# EAGLE design Nathan_Project-Speaker (EAGLE 8.3.2)
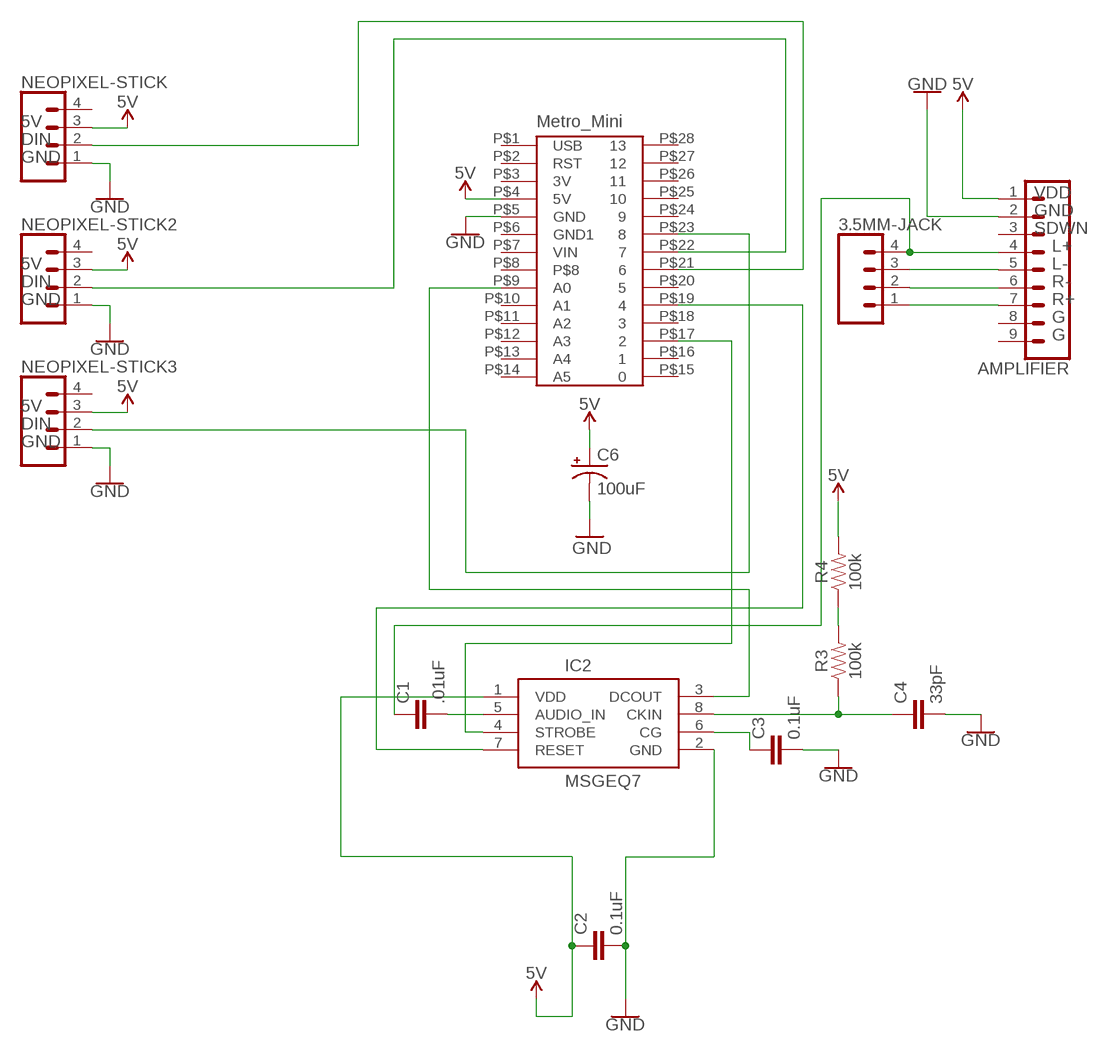
[diagram p0: schematic, sheet 1]

## Parts
3.5MM-JACK  CONN_04LOCK_LONGPADS  [1X04_LOCK_LONGPADS]
AMPLIFIER  CONN_09LOCK-LONGPADS  [1X09_LOCK_LONGPADS]
C1  .01uF  C5/2.5  [C5B2.5]
C2  0.1uF  C5/2.5  [C5B2.5]
C3  0.1uF  C5/2.5  [C5B2.5]
C4  33pF  C5/2.5  [C5B2.5]
C6  100uF  100UF-POLAR-RADIAL-2.5MM-25V-20%  [CPOL-RADIAL-2.5MM-6.5MM]
IC2  MSGEQ7P  MSGEQ7DIL  [DIP08]
NEOPIXEL-STICK  CONN_04LOCK_LONGPADS  [1X04_LOCK_LONGPADS]
NEOPIXEL-STICK2  CONN_04LOCK_LONGPADS  [1X04_LOCK_LONGPADS]
NEOPIXEL-STICK3  CONN_04LOCK_LONGPADS  [1X04_LOCK_LONGPADS]
R3  100k  100KOHM-HORIZ-1/4W-1%  [AXIAL-0.3]
R4  100k  100KOHM-HORIZ-1/4W-1%  [AXIAL-0.3]
U$2  METRO-MINI  [METRO-MINI]

## Nets
5V: AMPLIFIER.1 C2.1 C6.1(+) IC2.1(VDD) NEOPIXEL-STICK2.3 NEOPIXEL-STICK3.3 NEOPIXEL-STICK.3 R4.P$2 U$2.P$4(5V)
DIN: NEOPIXEL-STICK.2 U$2.P$21
GND: AMPLIFIER.2 C2.2 C3.2 C4.2 C6.2(-) IC2.2(GND) NEOPIXEL-STICK2.1 NEOPIXEL-STICK3.1 NEOPIXEL-STICK.1 U$2.P$5(GND)
N$1: C4.1 IC2.8(CKIN) R3.P$1
N$2: IC2.4(STROBE) U$2.P$17
N$3: NEOPIXEL-STICK3.2 U$2.P$23
N$4: 3.5MM-JACK.4 AMPLIFIER.4 C1.1
N$5: 3.5MM-JACK.3 AMPLIFIER.5
N$6: 3.5MM-JACK.2 AMPLIFIER.6
N$7: 3.5MM-JACK.1 AMPLIFIER.7
N$8: C3.1 IC2.6(CG)
N$9: R3.P$2 R4.P$1
N$10: C1.2 IC2.5(AUDIO_IN)
N$11: IC2.7(RESET) U$2.P$19
N$12: IC2.3(DCOUT) U$2.P$9(A0)
N$14: NEOPIXEL-STICK2.2 U$2.P$22
Unconnected: AMPLIFIER.3 AMPLIFIER.8 AMPLIFIER.9 NEOPIXEL-STICK2.4 NEOPIXEL-STICK3.4 NEOPIXEL-STICK.4 U$2.P$1(USB) U$2.P$2(RST) U$2.P$3(3V) U$2.P$6(GND1) U$2.P$7(VIN) U$2.P$8 U$2.P$10(A1) U$2.P$11(A2) U$2.P$12(A3) U$2.P$13(A4) U$2.P$14(A5) U$2.P$15 U$2.P$16 U$2.P$18 U$2.P$20 U$2.P$24 U$2.P$25 U$2.P$26 U$2.P$27 U$2.P$28

## Notes on the sheet
- 5V
- DIN
- GND
- VDD
- GND
- SDWN
- L+
- 5V | L-
- DIN | R-
- GND | R+
- G
- G
- 5V
- DIN
- GND

## Library data of the parts
3.5MM-JACK NEOPIXEL-STICK NEOPIXEL-STICK2 NEOPIXEL-STICK3 = SparkFun-Connectors:CONN_04: Multi connection point. Often used as Generic Header-pin footprint for 0.1 inch spaced/style header connections On any of the 0.1 inch spaced packages, you can populate with these: Break Away Headers - Straight <https://www.sparkfun.com/products/116> (PRT-00116) Break Away Male Headers - Right Angle <https://www.sparkfun.com/products/553> (PRT-00553) Female Headers <https://www.sparkfun.com/products/115> (PRT-00115) Break Away Headers - Machine Pin <https://www.sparkfun.com/products/117> (PRT-00117) Break Away Female Headers - Swiss Machine Pin <https://www.sparkfun.com/products/743> (PRT-00743) For SCREWTERMINALS and SPRING TERMINALS visit here: Screw Terimnals on SparkFun.com <https://www.sparkfun.com/search/results?term=Screw+Terminals> (5mm/3.5mm/2.54mm spacing) This device is also useful as a general connection point to wire up your design to another part of your project. Our various solder wires solder well into these plated through hole pads. Hook-Up Wire - Assortment (Stranded, 22 AWG) <https://www.sparkfun.com/products/11375> (PRT-11375) Hook-Up Wire - Assortment (Solid Core, 22 AWG) <https://www.sparkfun.com/products/11367> (PRT-11367) View the entire wire category on our website here <https://www.sparkfun.com/categories/141> Special notes: Molex polarized connector foot print use with SKU : PRT-08231 with associated crimp pins and housings. 1MM SMD Version SKU: PRT-10208; PROD_ID: CONN-09696
AMPLIFIER = SparkFun-Connectors:CONN_09: Multi connection point. Often used as Generic Header-pin footprint for 0.1 inch spaced/style header connections On any of the 0.1 inch spaced packages, you can populate with these: Break Away Headers - Straight <https://www.sparkfun.com/products/116> (PRT-00116) Break Away Male Headers - Right Angle <https://www.sparkfun.com/products/553> (PRT-00553) Female Headers <https://www.sparkfun.com/products/115> (PRT-00115) Break Away Headers - Machine Pin <https://www.sparkfun.com/products/117> (PRT-00117) Break Away Female Headers - Swiss Machine Pin <https://www.sparkfun.com/products/743> (PRT-00743) For SCREWTERMINALS and SPRING TERMINALS visit here: Screw Terimnals on SparkFun.com <https://www.sparkfun.com/search/results?term=Screw+Terminals> (5mm/3.5mm/2.54mm spacing) This device is also useful as a general connection point to wire up your design to another part of your project. Our various solder wires solder well into these plated through hole pads. Hook-Up Wire - Assortment (Stranded, 22 AWG) <https://www.sparkfun.com/products/11375> (PRT-11375) Hook-Up Wire - Assortment (Solid Core, 22 AWG) <https://www.sparkfun.com/products/11367> (PRT-11367) View the entire wire category on our website here <https://www.sparkfun.com/categories/141> Special notes: Molex polarized connector foot print use with SKU : PRT-08231 with associated crimp pins and housings. 1MM SMD Version SKU: PRT-10208 NOTES ON THE VARIANTS LOCK and LOCK_LONGPADS... This footprint was designed to help hold the alignment of a through-hole component (i.e. 6-pin header) while soldering it into place. You may notice that each hole has been shifted either up or down by 0.005 of an inch from it's more standard position (which is a perfectly straight line). This slight alteration caused the pins (the squares in the middle) to touch the edges of the holes. Because they are alternating, it causes a "brace" to hold the component in place. 0.005 has proven to be the perfect amount of "off-center" position when using our standard breakaway headers. Although looks a little odd when you look at the bare footprint, once you have a header in there, the alteration is very hard to notice. Also,if you push a header all the way into place, it is covered up entirely on the bottom side.
C1-C4 = NathanLibrary:C: CAPACITOR naming: grid - package width
C6 = NathanLibrary:100UF-POLAR: 100µF polarized capacitors A capacitor is a passive two-terminal electrical component used to store electrical energy temporarily in an electric field.; PROD_ID: CAP-08439
IC2 = SparkFun-IC-Special-Function:MSGEQ7: 7-band graphic equalizer This IC is for making a 7 band/channel audio spectrometer. There are two versions of this part. The DIP available on the storefront, and the SO used in product. Datasheet <https://www.sparkfun.com/datasheets/Components/General/MSGEQ7.pdf> SparkFun Products Storefront component: Graphic Equalizer Display Filter - MSGEQ7 <https://www.sparkfun.com/products/10468> (COM-10468) SparkFun Spectrum Shield <https://www.sparkfun.com/products/13116> (DEV-13116); PROD_ID: IC-12196
R3 R4 = NathanLibrary:100KOHM: 100kΩ resistor A resistor is a passive two-terminal electrical component that implements electrical resistance as a circuit element. Resistors act to reduce current flow, and, at the same time, act to lower voltage levels within circuits. - Wikipedia; PROD_ID: RES-12184
U$2 = Metro-Nate:METRO-MINI

## Net classes
0 default: width 0.457 mm, drill 0.457 mm, clearance 0.457 mm

## Board
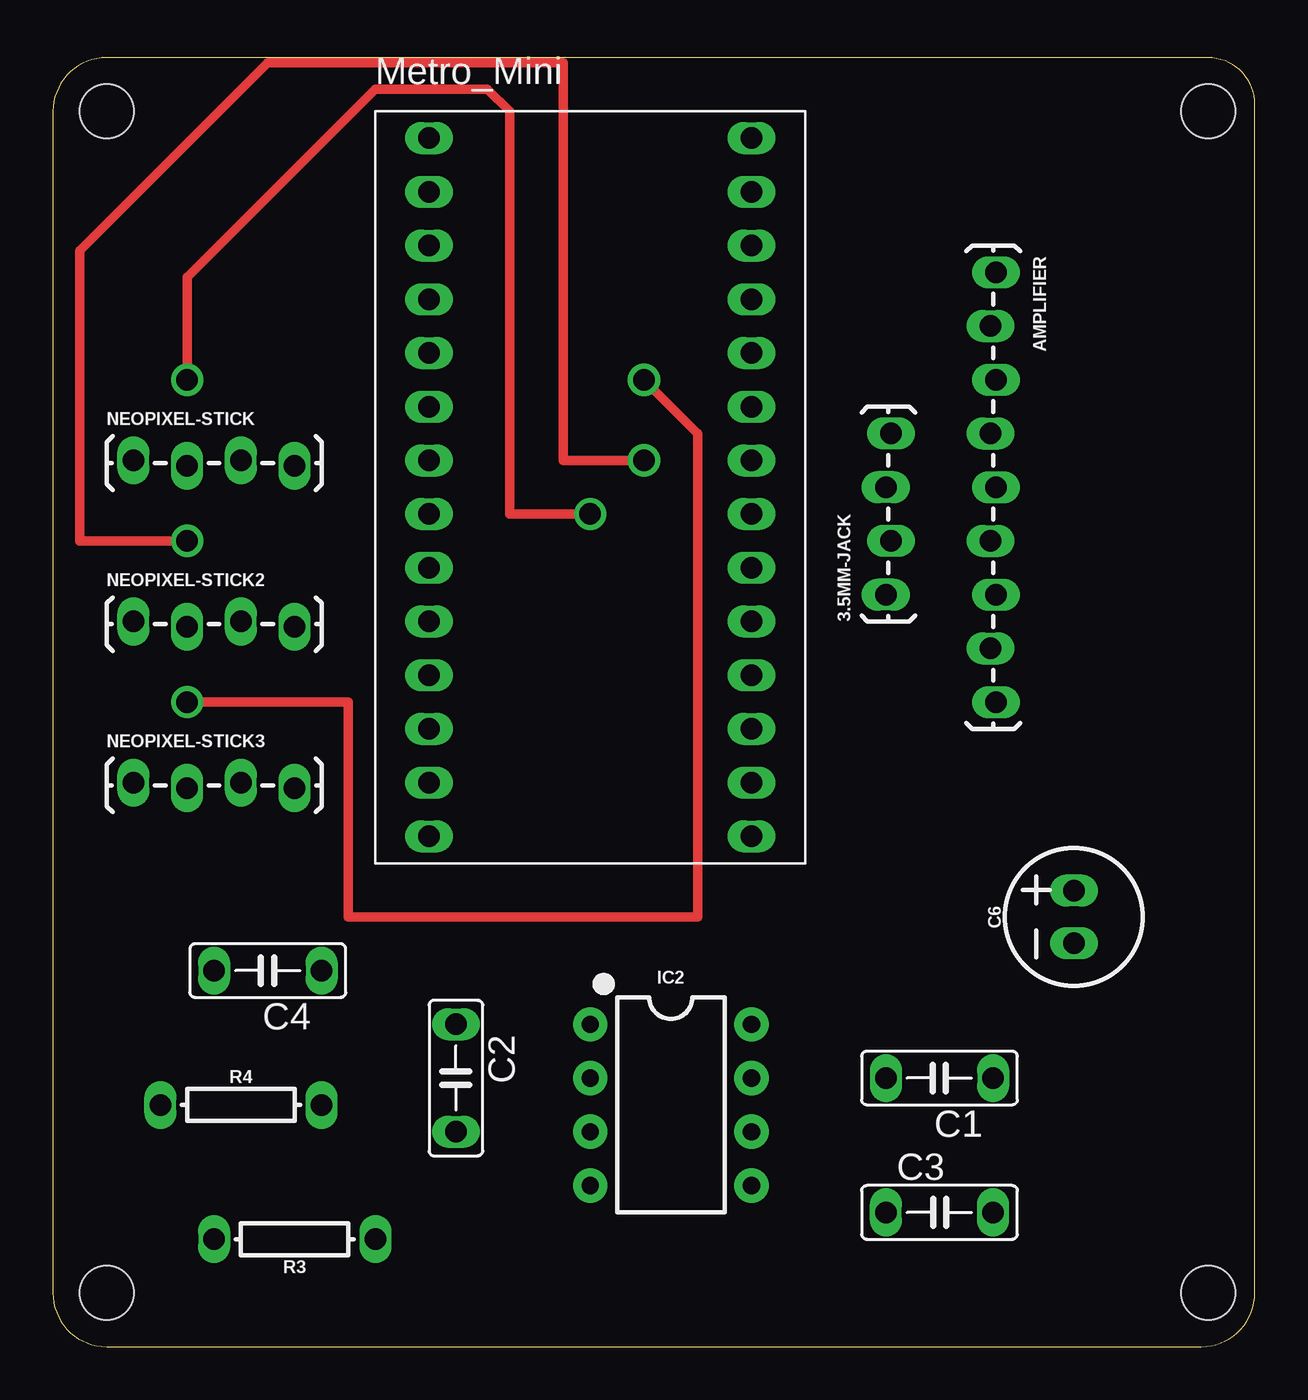
[diagram p1: board, top side]
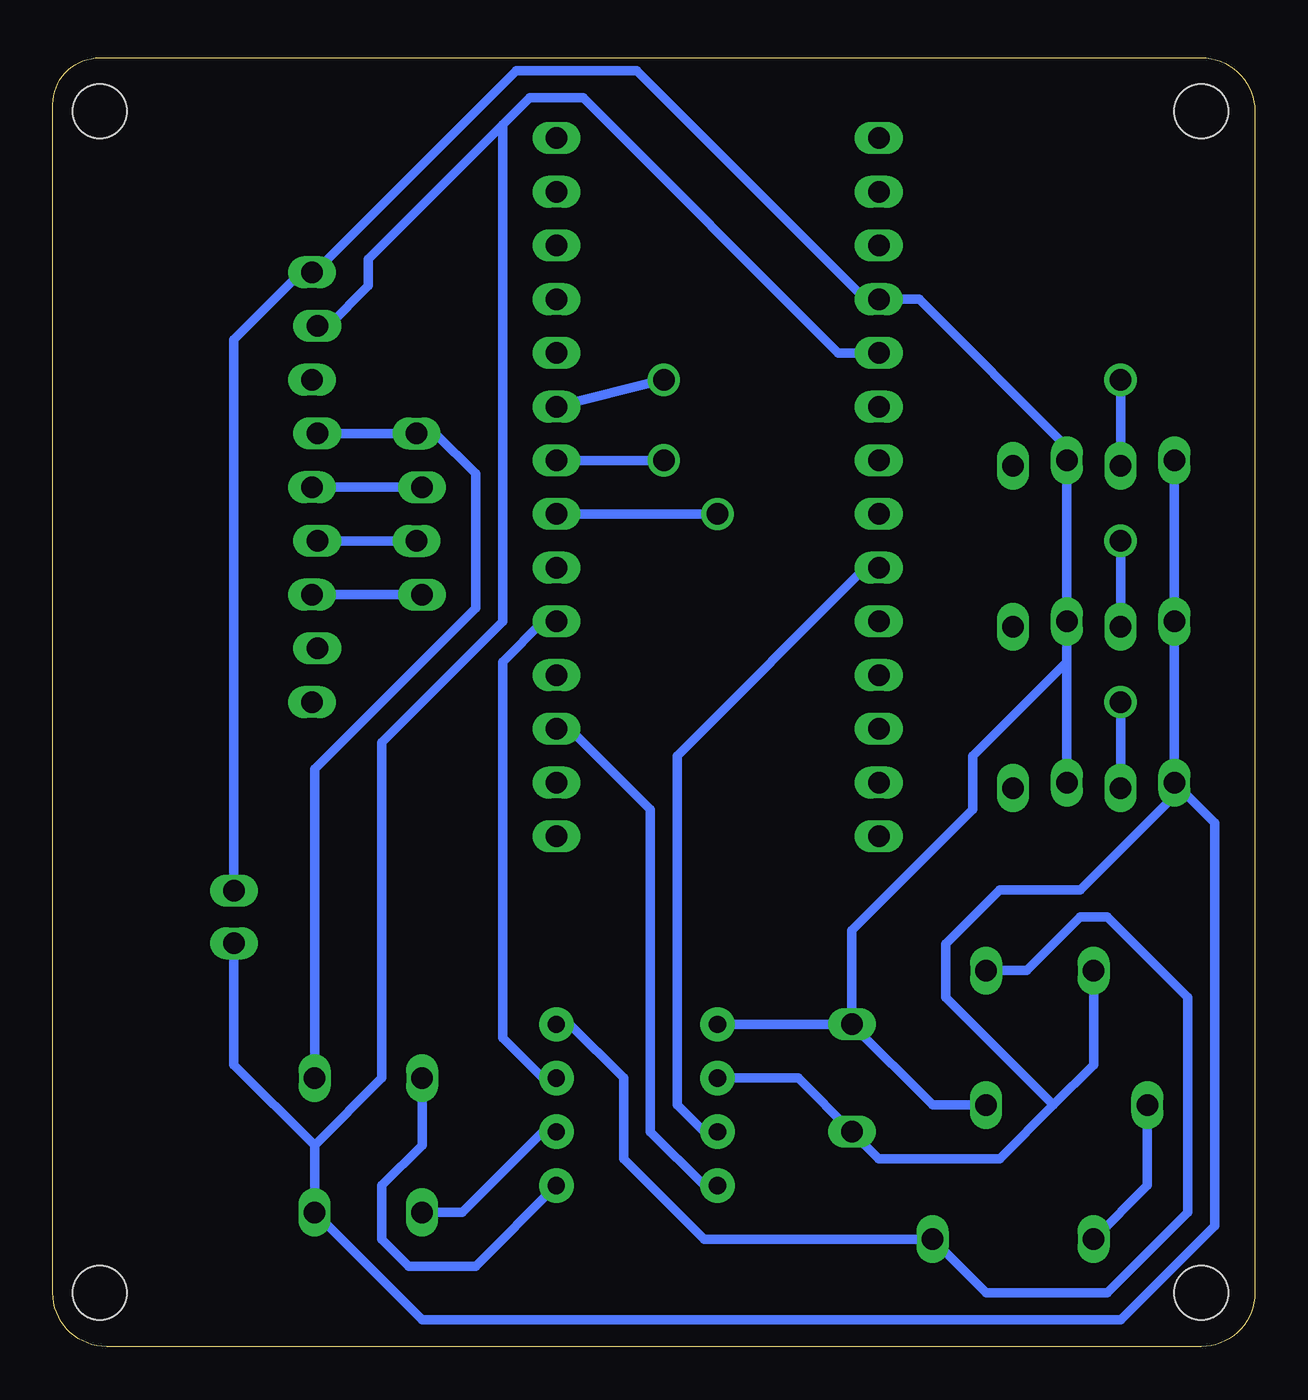
[diagram p2: board, bottom side, seen from below]

Size 56.82 x 60.95 mm. Coordinates in mm from the lower left corner, seen from the top.
Outline: 0,58.41 0,2.54 arc90 2.54,0 54.28,0 arc90 56.82,2.54 56.82,58.74 arc90 54.61,60.95 2.54,60.95 arc90 0,58.41
Copper layers (1*16): Top 0.035mm / dielectric 1.5mm / Bottom 0.035mm
Design rules "Othermill-DRC-1-32": minimum track width 8mil, minimum drill 0.8mm, track to track 0.794003125mm, track to pad 0.794003125mm, pad to pad 0.794003125mm, via to via 0.794003125mm, smd to smd 0mil, copper to edge 0mil, drill to drill 1mil, minimum pad ring 10mil, minimum via ring 10mil, stop-mask expansion 1mil, vias tented up to drill 30mil, thermal gap 10mil
Holes 2.54 mm at 2.54,2.54 54.61,2.54 54.61,58.42 2.54,58.42

### Footprints (pad centres in the part's own frame; a part is rotated, then mirrored left to right if it is on the bottom)
1X04_LOCK_LONGPADS = drill 1.016 long: 1 0,0; 2 2.54,-0.254; 3 5.08,0; 4 7.62,-0.254
1X09_LOCK_LONGPADS = drill 1.016 long: 1 0,0.127; 2 2.54,-0.127; 3 5.08,0.127; 4 7.62,-0.127; 5 10.16,0.127; 6 12.7,-0.127; 7 15.24,0.127; 8 17.78,-0.127; 9 20.32,0.127
C5B2.5 = drill 1.016 long: 1 -2.54,0; 2 2.54,0
CPOL-RADIAL-2.5MM-6.5MM = drill 1.016 long: 1 1.25,0; 2 -1.25,0
DIP08 = drill 0.813 pad 1.626: 1 -3.81,-3.81; 2 -1.27,-3.81; 3 1.27,-3.81; 4 3.81,-3.81; 5 3.81,3.81; 6 1.27,3.81; 7 -1.27,3.81; 8 -3.81,3.81
AXIAL-0.3 = drill 1.016 long: P$1 -3.81,0; P$2 3.81,0
METRO-MINI = drill 1.016 long: P$1 -7.62,16.51; P$2 -7.62,13.97; P$3 -7.62,11.43; P$4 -7.62,8.89; P$5 -7.62,6.35; P$6 -7.62,3.81; P$7 -7.62,1.27; P$8 -7.62,-1.27; P$9 -7.62,-3.81; P$10 -7.62,-6.35; P$11 -7.62,-8.89; P$12 -7.62,-11.43; P$13 -7.62,-13.97; P$14 -7.62,-16.51; P$15 7.62,-16.51; P$16 7.62,-13.97; P$17 7.62,-11.43; P$18 7.62,-8.89; P$19 7.62,-6.35; P$20 7.62,-3.81; P$21 7.62,-1.27; P$22 7.62,1.27; P$23 7.62,3.81; P$24 7.62,6.35; P$25 7.62,8.89; P$26 7.62,11.43; P$27 7.62,13.97; P$28 7.62,16.51

### Placement (x,y rotation side)
3.5MM-JACK  39.37,35.56 90 top
AMPLIFIER  44.45,50.8 270 top
C1  41.91,12.7 180 top
C2  19.05,12.7 270 top
C3  41.91,6.35 0 top
C4  10.16,17.78 180 top
C6  48.26,20.32 90 top
IC2  29.21,11.43 270 top
NEOPIXEL-STICK  3.81,41.91 0 top
NEOPIXEL-STICK2  3.81,34.29 0 top
NEOPIXEL-STICK3  3.81,26.67 0 top
R3  11.43,5.08 180 top
R4  8.89,11.43 0 top
U$2  25.4,40.64 0 top

### Tracks (layer width: path | path; a pad name or v marks a point on that pad's centre or on a via)
5V
  Bottom 0.457: C6.1 48.26,47.62 45.09,50.8 AMPLIFIER.1 44.45,50.8 34.92,60.33 29.21,60.33 18.42,49.53 U$2.P$4 15.88,49.53 8.89,42.55 NEOPIXEL-STICK.3 NEOPIXEL-STICK2.3 8.89,32.39 | R4.P$2 15.24,11.43 C2.1 | C2.1 IC2.1 | 8.89,32.39 NEOPIXEL-STICK3.3 | C2.1 19.05,19.68 13.34,25.4 13.34,27.94 8.89,32.39
DIN  (via drill 1.02)
  Top 0.457: v25.4,39.37 21.59,39.37 21.59,58.42 20.54,59.47 15.24,59.47 6.35,50.58 v6.35,45.72
  Bottom 0.457: NEOPIXEL-STICK.2 v6.35,45.72 | v25.4,39.37 U$2.P$21
GND
  Bottom 0.457: NEOPIXEL-STICK3.1 NEOPIXEL-STICK2.1 NEOPIXEL-STICK.1 | C4.2 7.62,13.33 9.53,11.43 | 9.53,11.43 12.07,8.89 17.78,8.89 C2.2 21.59,12.7 IC2.2 | NEOPIXEL-STICK3.1 3.81,26.04 8.25,21.59 12.07,21.59 14.61,19.05 14.61,16.51 9.53,11.43 | 44.45,9.52 C3.2 39.37,1.27 6.35,1.27 1.91,5.71 1.91,24.76 NEOPIXEL-STICK3.1 | 44.45,9.52 48.26,13.33 C6.2 | U$2.P$5 19.68,46.99 31.75,59.06 34.29,59.06 35.56,57.78 | 35.56,57.78 41.91,51.44 41.91,50.17 43.81,48.26 AMPLIFIER.2 | 44.45,9.52 41.28,12.7 41.28,28.57 35.56,34.29 35.56,57.78
N$1
  Bottom 0.457: C4.1 10.79,17.78 8.25,20.32 6.98,20.32 3.18,16.51 3.18,6.35 6.98,2.54 12.7,2.54 R3.P$1 26.04,5.08 29.85,8.89 29.85,12.7 32.39,15.24 IC2.8
N$2
  Bottom 0.457: U$2.P$17 32.39,29.21 28.57,25.4 28.57,10.16 26.04,7.62 IC2.4
N$3  (via drill 1.02)
  Top 0.457: v6.35,30.48 13.97,30.48 13.97,20.32 29.21,20.32 30.48,20.32 30.48,43.18 v27.94,45.72
  Bottom 0.457: NEOPIXEL-STICK3.2 v6.35,30.48 | v27.94,45.72 U$2.P$23
N$4
  Bottom 0.457: AMPLIFIER.4 3.5MM-JACK.4 38.73,43.18 36.83,41.28 36.83,34.92 44.45,27.3 C1.1
N$5
  Bottom 0.457: AMPLIFIER.5 3.5MM-JACK.3
N$6
  Bottom 0.457: AMPLIFIER.6 3.5MM-JACK.2
N$7
  Bottom 0.457: AMPLIFIER.7 3.5MM-JACK.1
N$8
  Bottom 0.457: C3.1 37.47,6.35 33.66,10.16 IC2.6
N$9
  Bottom 0.457: R4.P$1 5.08,7.62 R3.P$2
N$10
  Bottom 0.457: C1.2 39.37,9.52 41.28,7.62 41.28,5.08 40.01,3.81 36.83,3.81 IC2.5
N$11
  Bottom 0.457: U$2.P$19 33.66,34.29 35.56,32.39 35.56,14.61 33.66,12.7 IC2.7
N$12
  Bottom 0.457: U$2.P$9 18.42,36.83 27.31,27.94 27.31,11.43 26.04,10.16 IC2.3
N$14  (via drill 1.02)
  Top 0.457: v6.35,38.1 1.27,38.1 1.27,51.83 10.16,60.72 24.13,60.72 24.13,41.91 v27.94,41.91
  Bottom 0.457: NEOPIXEL-STICK2.2 v6.35,38.1 | v27.94,41.91 U$2.P$22